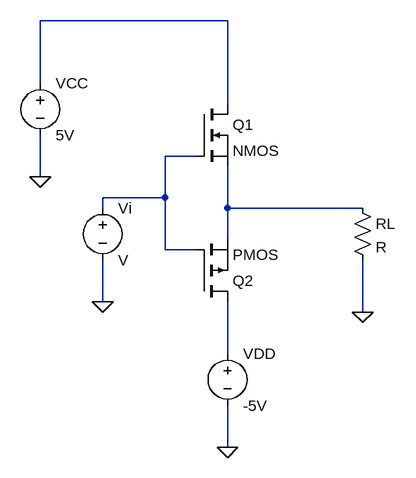
[diagram p0: schematic A4.asc]
A4.asc, the LTspice schematic file:
Version 4
SHEET 1 880 680
WIRE 96 -1184 -192 -1184
WIRE -192 -1088 -192 -1184
WIRE 96 -1056 96 -1184
WIRE 48 -976 0 -976
WIRE -192 -944 -192 -1008
WIRE 0 -912 0 -976
WIRE 0 -912 -96 -912
WIRE -96 -896 -96 -912
WIRE 96 -896 96 -960
WIRE 304 -896 96 -896
WIRE 96 -848 96 -896
WIRE 0 -832 0 -912
WIRE 48 -832 0 -832
WIRE -96 -752 -96 -816
WIRE 304 -736 304 -816
WIRE 96 -672 96 -752
WIRE 96 -528 96 -592
FLAG 304 -736 0
FLAG -192 -944 0
FLAG 96 -528 0
FLAG -96 -752 0
SYMBOL nmos 48 -1056 R0
SYMATTR InstName Q1
SYMBOL pmos 48 -752 M180
SYMATTR InstName Q2
SYMBOL res 288 -912 R0
SYMATTR InstName RL
SYMBOL voltage -192 -1104 R0
WINDOW 123 0 0 Left 2
WINDOW 39 0 0 Left 2
SYMATTR InstName VCC
SYMATTR Value 5V
SYMBOL voltage 96 -688 R0
WINDOW 123 0 0 Left 2
WINDOW 39 0 0 Left 2
SYMATTR InstName VDD
SYMATTR Value -5V
SYMBOL voltage -96 -912 R0
SYMATTR InstName Vi

The netlist it stands for:
* A4.asc
M§Q1 N001 N002 N003 N003 NMOS
M§Q2 N004 N002 N003 N003 PMOS
RL N003 0 R
VCC N001 0 5V
VDD N004 0 -5V
Vi N002 0 V
.model NMOS NMOS
.model PMOS PMOS
.lib standard.mos
.backanno
.end